# EAGLE design BLDController_v1.0 (EAGLE 6.6.0)
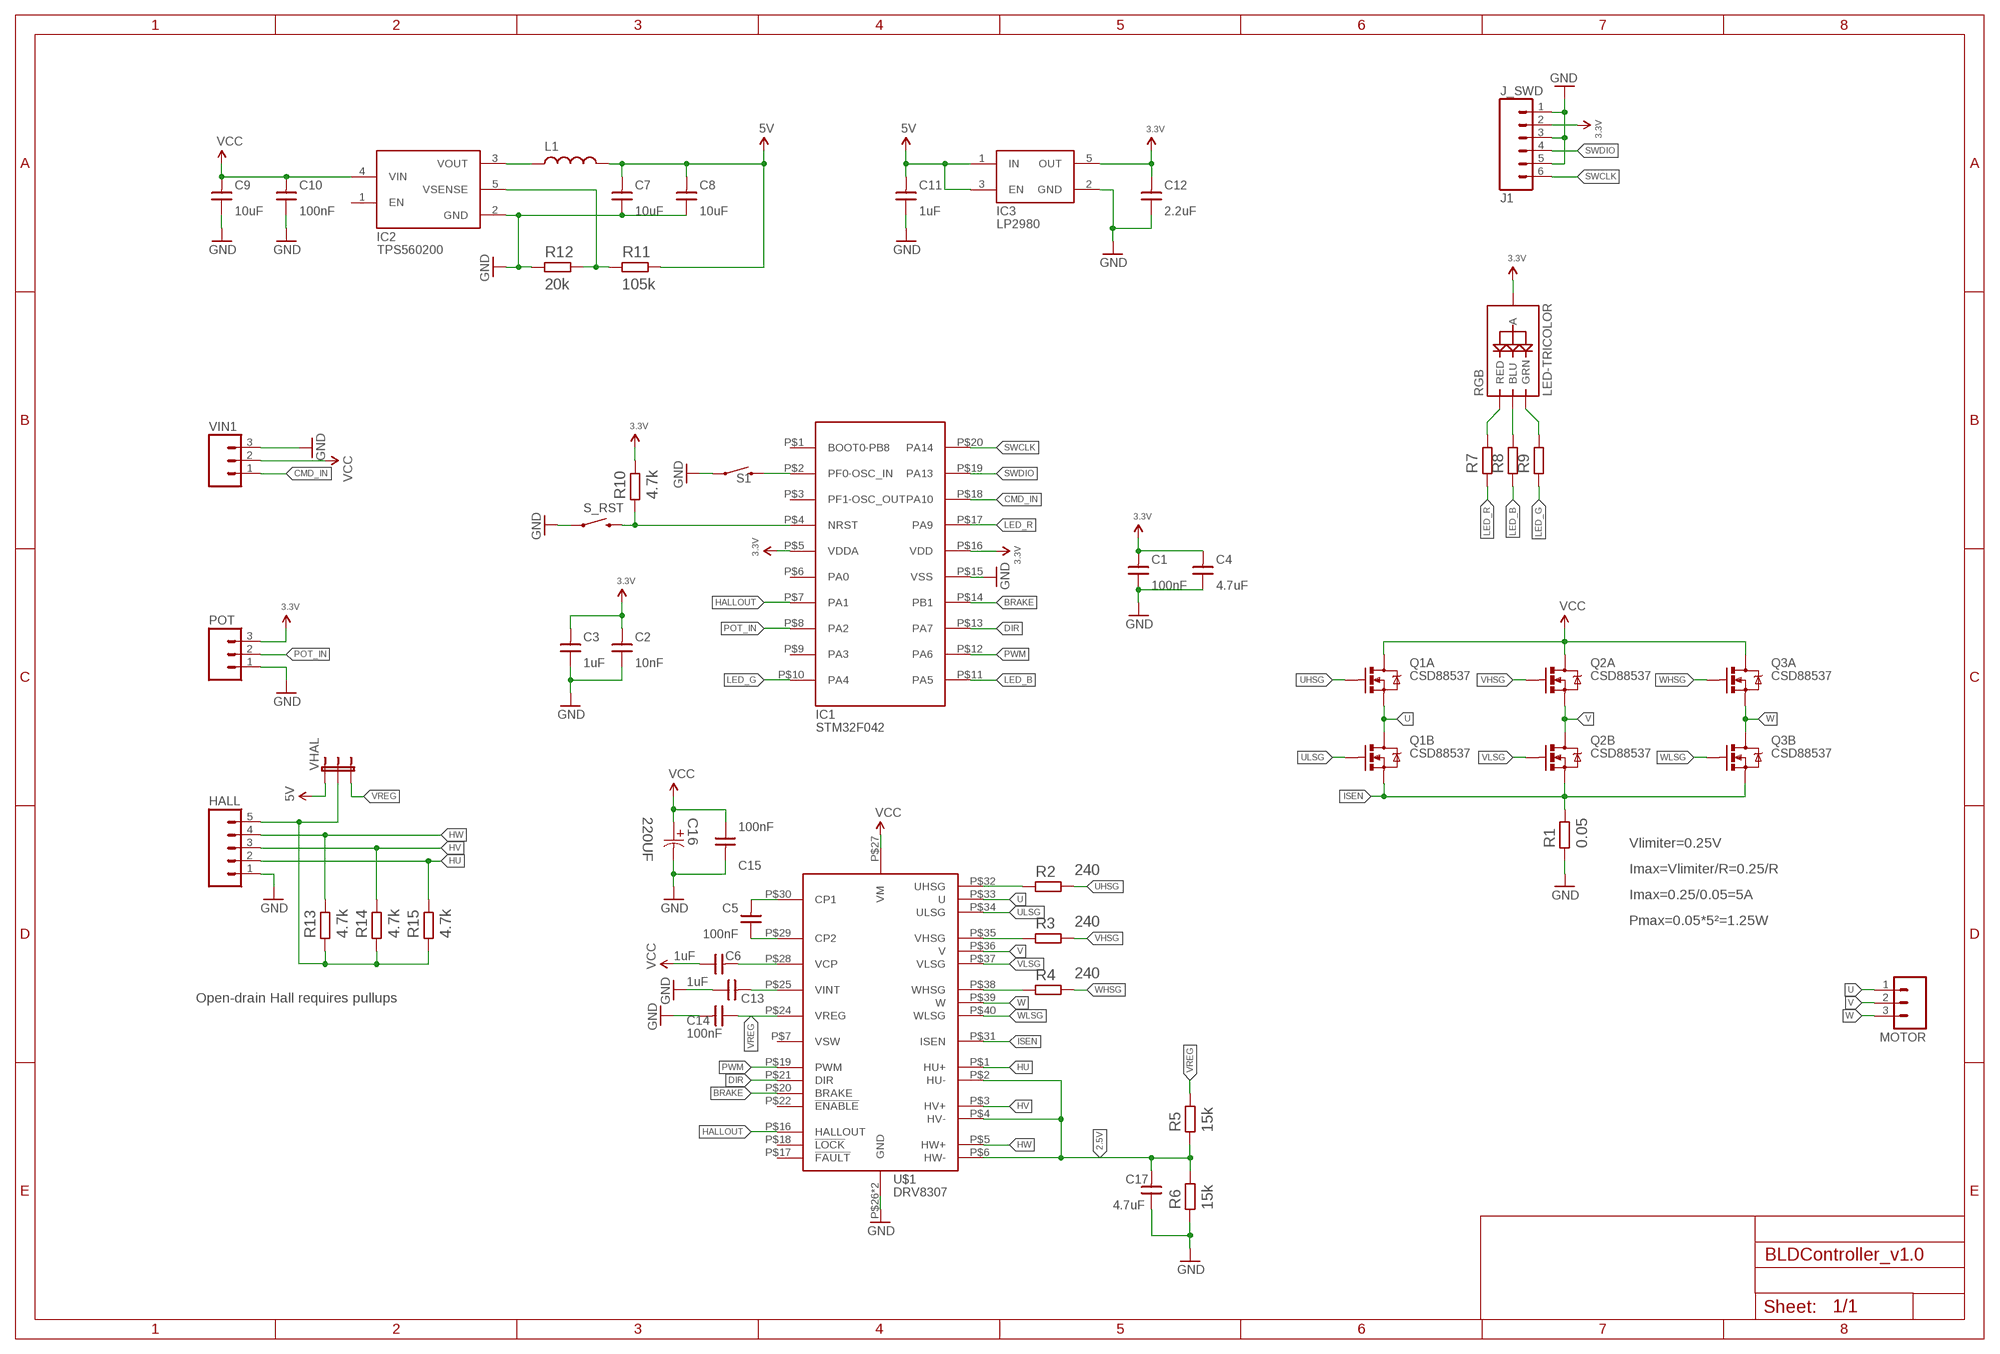
[diagram p0: schematic, sheet 1]

## Parts
C1  100nF  C0603  [R0603]
C2  10nF  C0603  [R0603]
C3  1uF  C0805  [R0805]
C4  4.7uF  C0805  [R0805]
C5  100nF  C0603  [R0603]
C6  1uF  C0805  [R0805]
C7  10uF  C0805  [R0805]
C8  10uF  C0805  [R0805]
C9  10uF  C1206  [1206]
C10  100nF  C0603  [R0603]
C11  1uF  C0805  [R0805]
C12  2.2uF  C0805  [R0805]
C13  1uF  C0805  [R0805]
C14  100nF  C0603  [R0603]
C15  100nF  C0603  [R0603]
C16  220UF  C_PANAFC1V221-P5.0-D10  [CAPPR500-1000X3200]
C17  4.7uF  C0603  [R0603]
HALL  M05SCREW  [SCREWTERMINAL-3.5MM-5]
IC1  STM32F042  [TSSOP20]
IC2  TPS560200  [SOT23-5L]
IC3  LP2980  [SOT23-5L]
J1  J_SWD  ZIF-06-1MM  [ZIF-06-1MM]
L1  LNRG_4026  [NRG_4026]
MOTOR  M03-SCREW-5MM  [SCREWTERMINAL-5MM-3]
POT  M03SCREW  [SCREWTERMINAL-3.5MM-3]
Q1  CSD88537  [SO-08]
Q2  CSD88537  [SO-08]
Q3  CSD88537  [SO-08]
R1  0.05  R2512  [CRF2512]
R2  240  R0603  [R0603]
R3  240  R0603  [R0603]
R4  240  R0603  [R0603]
R5  15k  R0603  [R0603]
R6  15k  R0603  [R0603]
R7  R0603  [R0603]
R8  R0603  [R0603]
R9  R0603  [R0603]
R10  4.7k  R0603  [R0603]
R11  105k  R0603  [R0603]
R12  20k  R0603  [R0603]
R13  4.7k  R0603  [R0603]
R14  4.7k  R0603  [R0603]
R15  4.7k  R0603  [R0603]
RGB  LED-TRICOLOR  [PLCC4]
S1  SWITCH-MOMENTARY-2SMD-3  [TACTILE_SWITCH_SMD-3]
S_RST  SWITCH-MOMENTARY-2SMD-3  [TACTILE_SWITCH_SMD-3]
U$1  DRV8307  [PVQFN-N40]
VHAL  JUMPER-3SMD  [SJ_3]
VIN1  M03SCREW  [SCREWTERMINAL-3.5MM-3]

## Nets
2.5V: C17.2 R5.1 R6.2 U$1.P$2(HU-) U$1.P$4(HV-) U$1.P$6(HW-)
3.3V: C1.2 C2.2 C3.2 C4.2 C12.2 IC1.P$5(VDDA) IC1.P$16(VDD) IC3.5(OUT) J1.2 POT.3 R10.2 RGB.P$1(A)
5V: C7.2 C8.2 C11.2 IC3.1(IN) IC3.3(EN) L1.P$2 R11.2 VHAL.1
BRAKE: IC1.P$14(PB1) U$1.P$20(BRAKE)
CMD_IN: IC1.P$18(PA10) VIN1.1
DIR: IC1.P$13(PA7) U$1.P$21(DIR)
GND: C1.1 C2.1 C3.1 C4.1 C7.1 C8.1 C9.1 C10.1 C11.1 C12.1 C13.1 C14.2 C15.2 C16.2 C17.1 HALL.1 IC1.P$15(VSS) IC2.2(GND) IC3.2(GND) J1.1 J1.3 J1.5 POT.1 R1.P$1 R6.1 R12.1 S1.1 S_RST.1 U$1.P$26(GND) U$1.PAD(GND) VIN1.3
HALLOUT: IC1.P$7(PA1) U$1.P$16(HALLOUT)
HU: HALL.2 R15.2 U$1.P$1(HU+)
HV: HALL.3 R14.2 U$1.P$3(HV+)
HW: HALL.4 R13.2 U$1.P$5(HW+)
ISEN: Q1.3(B:S) Q2.3(B:S) Q3.3(B:S) R1.P$2 U$1.P$31(ISEN)
LED_B: IC1.P$11(PA5) R8.1
LED_G: IC1.P$10(PA4) R9.1
LED_R: IC1.P$17(PA9) R7.1
N$1: C5.2 U$1.P$30(CP1)
N$2: C5.1 U$1.P$29(CP2)
N$4: C13.2 U$1.P$25(VINT)
N$5: C6.2 U$1.P$28(VCP)
N$6: R4.1 U$1.P$38(WHSG)
N$9: R7.2 RGB.P$4(RED)
N$10: R8.2 RGB.P$2(BLU)
N$11: R9.2 RGB.P$3(GRN)
N$12: R2.1 U$1.P$32(UHSG)
N$13: R3.1 U$1.P$35(VHSG)
N$18: IC1.P$4(NRST) R10.1 S_RST.4
N$27: IC2.3(VOUT) L1.P$1
N$29: IC2.5(VSENSE) R11.1 R12.2
POT_IN: IC1.P$8(PA2) POT.2
PWM: IC1.P$12(PA6) U$1.P$19(PWM)
SW1: IC1.P$2(PF0-OSC_IN) S1.4
SWCLK: IC1.P$20(PA14) J1.6
SWDIO: IC1.P$19(PA13) J1.4
U: MOTOR.1 Q1.1(A:S) Q1.5(B:D) Q1.6(B:D) U$1.P$33(U)
UHSG: Q1.2(A:G) R2.2
ULSG: Q1.4(B:G) U$1.P$34(ULSG)
V: MOTOR.2 Q2.1(A:S) Q2.5(B:D) Q2.6(B:D) U$1.P$36(V)
VCC: C6.1 C9.2 C10.2 C15.1 C16.1 IC2.4(VIN) Q1.7(A:D) Q1.8(A:D) Q2.7(A:D) Q2.8(A:D) Q3.7(A:D) Q3.8(A:D) U$1.P$27(VM) VIN1.2
VHALL: HALL.5 R13.1 R14.1 R15.1 VHAL.2
VHSG: Q2.2(A:G) R3.2
VLSG: Q2.4(B:G) U$1.P$37(VLSG)
VREG: C14.1 R5.2 U$1.P$24(VREG) VHAL.3
W: MOTOR.3 Q3.1(A:S) Q3.5(B:D) Q3.6(B:D) U$1.P$39(W)
WHSG: Q3.2(A:G) R4.2
WLSG: Q3.4(B:G) U$1.P$40(WLSG)
Unconnected: IC1.P$1(BOOT0-PB8) IC1.P$3(PF1-OSC_OUT) IC1.P$6(PA0) IC1.P$9(PA3) IC2.1(EN) U$1.P$7(VSW) U$1.P$17(!FAULT) U$1.P$18(!LOCK) U$1.P$22(!ENABLE)

## Notes on the sheet
- Vlimiter=0.25V
- Imax=Vlimiter/R=0.25/R
- Imax=0.25/0.05=5A
- Pmax=0.05*5²=1.25W
- Open-drain Hall requires pullups

## Library data of the parts
C1-C15 C17 = 0SBLib:C
C16 = 0SBLib:C_PANA: Aluminum Electrolytic Capacitors; MPN: EEUFC1V221; OC_FARNELL: 9692282; OC_NEWARK: 80K8401; RATEDVOLTAGE: 35V; SUPPLIER: PANASONIC; TOLERANCE: ±20 %
HALL = 0SBLib:M05: Header 5 Standard 5-pin 0.1" header. Use with straight break away headers (SKU : PRT-00116), right angle break away headers (PRT-00553), swiss pins (PRT-00743), machine pins (PRT-00117), and female headers (PRT-00115). Molex polarized connector foot print use with SKU : PRT-08230 with associated crimp pins and housings.
IC1 = 0SBLib:STM32F042: ARM®-based 32-bit MCU, up to 32 KB Flash, crystal-less USB FS 2.0, CAN, 8 timers, ADC & comm. interfaces, 2.0 - 3.6 V
IC2 = 0SBLib:TPS560200
IC3 = 0SBLib:LP2980
J1 = 0SBLib:ZIF-06-1MM
L1 = 0SBLib:L
MOTOR POT VIN1 = 0SBLib:M03: Header 3 Standard 3-pin 0.1" header. Use with straight break away headers (SKU : PRT-00116), right angle break away headers (PRT-00553), swiss pins (PRT-00743), machine pins (PRT-00117), and female headers (PRT-00115). Molex polarized connector foot print use with SKU : PRT-08232 with associated crimp pins and housings.
Q1-Q3 = 0SBLib:CSD88537
R1-R15 = 0SBLib:R
RGB = 0SBLib:LED-TRICOLOR: Tri-Color LED SMD Proven layout and schematic for triple color LED in SMD package - common anode. Spark Fun Electronics SKU : COM-07844
S1 S_RST = SparkFun-Electromechanical:SWITCH-MOMENTARY-2: Various NO switches- pushbuttons, reed, etc
U$1 = 0SBLib:DRV8307
VHAL = 0SBLib:JUMPER-3

## Board
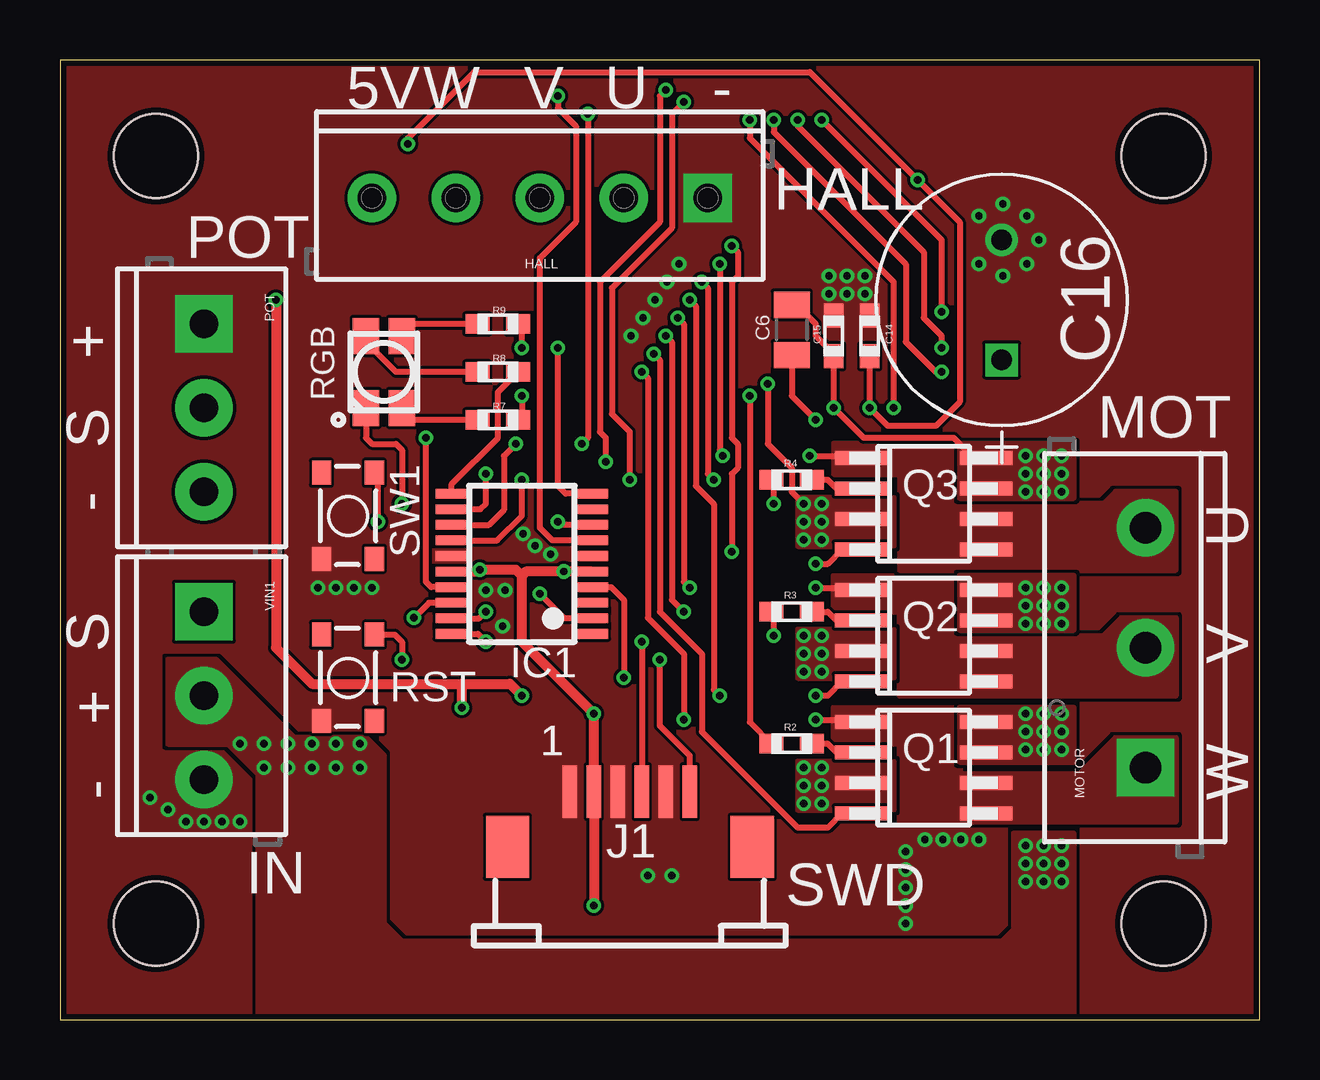
[diagram p1: board, top side]
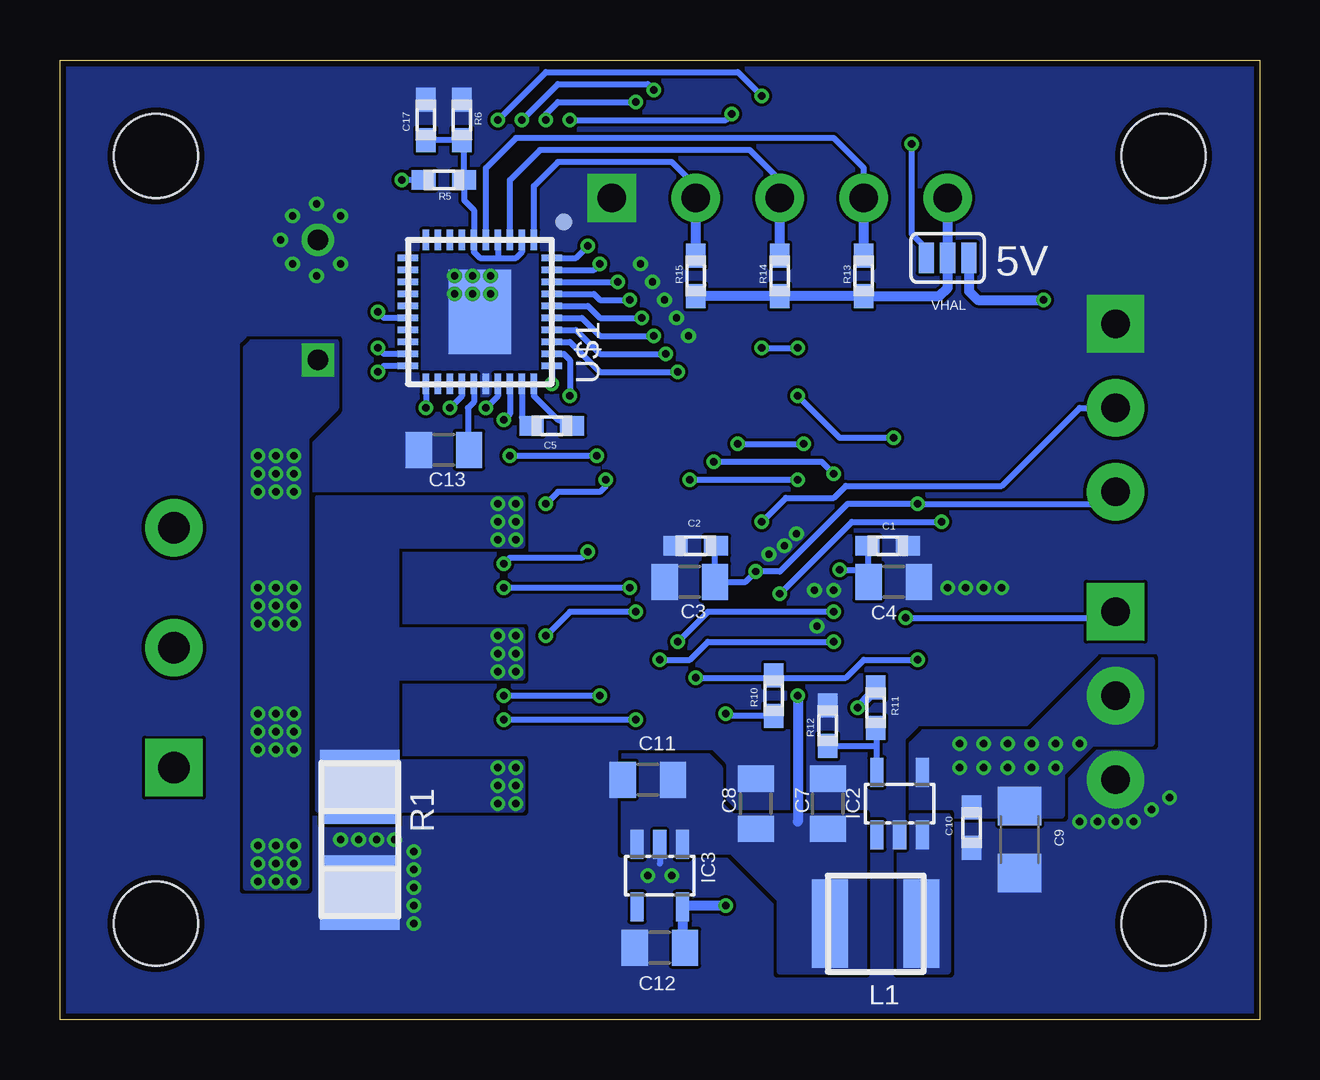
[diagram p2: board, bottom side, seen from below]

Size 50 x 40 mm. Coordinates in mm from the lower left corner, seen from the top.
Outline: 0,0 50,0 50,40 0,40 0,0
Copper layers (1*16): Top 0.035mm / dielectric 1.5mm / Bottom 0.035mm
Design rules "dirt_cheap_dirty_boards.v1": minimum track width 5mil, minimum drill 12mil, track to track 5mil, track to pad 5mil, pad to pad 5mil, via to via 5mil, smd to smd 0mil, copper to edge 10mil, drill to drill 10mil, minimum pad ring 10mil, minimum via ring 6mil, stop-mask expansion 2mil, vias tented up to drill 25mil, thermal gap 10mil
Holes 3.5 mm at 4,4 46,4 46,36 4,36

### Footprints (pad centres in the part's own frame; a part is rotated, then mirrored left to right if it is on the bottom)
R0603 = smd 1 x 0.8: 1 -0.85,0; 2 0.85,0
R0805 = smd 1.1 x 1.5: 1 -1.05,0; 2 1.05,0
1206 = smd 1.6 x 1.8: 1 -1.4,0; 2 1.4,0
CAPPR500-1000X3200 = drill 0.864 square: 1 -5.004,0 | drill 0.864: 2 0,0
SCREWTERMINAL-3.5MM-5 = drill 1.2 pad 2.032 square: 1 0,0 | drill 1.2 pad 2.032: 2 3.5,0; 3 7,0; 4 10.5,0; 5 14,0
TSSOP20 = smd 0.4 x 1.35: P$1 -2.925,-2.925; P$2 -2.275,-2.925; P$3 -1.625,-2.925; P$4 -0.975,-2.925; P$5 -0.325,-2.925; P$6 0.325,-2.925; P$7 0.975,-2.925; P$8 1.625,-2.925; P$9 2.275,-2.925; P$10 2.925,-2.925; P$11 2.925,2.925; P$12 2.275,2.925; P$13 1.625,2.925; P$14 0.975,2.925; P$15 0.325,2.925; P$16 -0.325,2.925; P$17 -0.975,2.925; P$18 -1.625,2.925; P$19 -2.275,2.925; P$20 -2.925,2.925
SOT23-5L = smd 0.55 x 1.2: 1 -0.95,-1.3; 2 0,-1.3; 3 0.95,-1.3; 4 0.95,1.3; 5 -0.95,1.3
ZIF-06-1MM = smd 0.6 x 2.2: 1 -2.5,1; 2 -1.5,1; 3 -0.5,1; 4 0.5,1; 5 1.5,1; 6 2.5,1 | smd 1.8 x 2.6: H1 -5.1,-1.3; H2 5.1,-1.3
NRG_4026 = smd 1.5 x 3.7: P$1 -1.9,0; P$2 1.9,0
SCREWTERMINAL-5MM-3 = drill 1.3 pad 2.413 square: 1 0,0 | drill 1.3 pad 2.413: 2 5,0; 3 10,0
SCREWTERMINAL-3.5MM-3 = drill 1.2 pad 2.413 square: 1 0,0 | drill 1.2 pad 2.413: 2 3.5,0; 3 7,0
SO-08 = smd 0.6 x 2.2: 1 -1.905,-2.6; 2 -0.635,-2.6; 3 0.635,-2.6; 4 1.905,-2.6; 5 1.905,2.6; 6 0.635,2.6; 7 -0.635,2.6; 8 -1.905,2.6
CRF2512 = smd 3.1 x 3.3: P$1 -2.2,0; P$2 2.2,0
PLCC4 = smd 1.1 x 1.5: P$1 -0.75,-1.5; P$2 -0.75,1.5; P$3 0.75,1.5; P$4 0.75,-1.5
TACTILE_SWITCH_SMD-3 = smd 1 x 0.8: 1 -1.8,1.1; 2 1.8,1.1; 3 -1.8,-1.1; 4 1.8,-1.1
PVQFN-N40 = smd 0.28 x 0.85: P$1 -2.25,-3; P$2 -1.75,-3; P$3 -1.25,-3; P$4 -0.75,-3; P$5 -0.25,-3; P$6 0.25,-3; P$7 0.75,-3; P$8 1.25,-3; P$9 1.75,-3; P$10 2.25,-3; P$21 2.25,3; P$22 1.75,3; P$23 1.25,3; P$24 0.75,3; P$25 0.25,3; P$26 -0.25,3; P$27 -0.75,3; P$28 -1.25,3; P$29 -1.75,3; P$30 -2.25,3 | smd 0.85 x 0.28: P$11 3,-2.25; P$12 3,-1.75; P$13 3,-1.25; P$14 3,-0.75; P$15 3,-0.25; P$16 3,0.25; P$17 3,0.75; P$18 3,1.25; P$19 3,1.75; P$20 3,2.25; P$31 -3,2.25; P$32 -3,1.75; P$33 -3,1.25; P$34 -3,0.75; P$35 -3,0.25; P$36 -3,-0.25; P$37 -3,-0.75; P$38 -3,-1.25; P$39 -3,-1.75; P$40 -3,-2.25 | smd 2.62 x 3.52: PAD 0,0
SJ_3 = smd 0.635 x 1.27: 1 -0.889,0; 2 0,0; 3 0.889,0

### Placement (x,y rotation side)
C1  15.5,19.75 180 bottom
C2  23.5,19.75 0 bottom
C3  23.75,18.25 0 bottom
C4  15.25,18.25 180 bottom
C5  29.5,24.75 0 bottom
C6  30.5,28.75 270 top
C7  18,9 270 bottom
C8  21,9 270 bottom
C9  10,7.5 90 bottom
C10  12,8 90 bottom
C11  25.5,10 0 bottom
C12  25,3 0 bottom
C13  34,23.75 0 bottom
C14  33.75,28.5 90 top
C15  32.25,28.5 90 top
C16  39.25,32.5 90 top
C17  34.75,37.5 270 bottom
HALL  27,34.25 180 top
IC1  19.25,19 90 top
IC2  15,9 0 bottom
IC3  25,6 180 bottom
J1  23.75,8.5 0 top
L1  16,4 180 bottom
MOTOR  45.25,10.5 90 top
POT  6,29 270 top
Q1  36,10.5 270 top
Q2  36,16 270 top
Q3  36,21.5 270 top
R1  37.5,7.5 90 bottom
R2  30.5,11.5 0 top
R3  30.5,17 0 top
R4  30.5,22.5 0 top
R5  34,35 180 bottom
R6  33.25,37.5 270 bottom
R7  18.25,25 180 top
R8  18.25,27 180 top
R9  18.25,29 180 top
R10  20.25,13.5 270 bottom
R11  16,13 90 bottom
R12  18,12.25 270 bottom
R13  16.5,31 90 bottom
R14  20,31 90 bottom
R15  23.5,31 90 bottom
RGB  13.5,27 0 top
S1  12,21 90 top
S_RST  12,14.25 90 top
U$1  32.5,29.5 180 bottom
VHAL  13,31.75 180 bottom
VIN1  6,17 270 top

### Tracks (layer width: path | path; a pad name or v marks a point on that pad's centre or on a via)
2.5V
  Bottom 0.254: U$1.P$2 30.75,32 31,31.75 31.75,31.75 | 31.75,31.75 32.5,31.75 32.75,32 U$1.P$6 32.75,33.75 33.15,34.15 R5.1 33.15,36.55 R6.2 C17.2 | U$1.P$4 31.75,31.75
3.3V  (via drill 0.3)
  Top 0.254: RGB.P$1 12.75,24.25 13,24 14,24 14.25,23.75 v14.25,21.5
  Top 0.406: v22.25,4.75 J1.2 v22.25,12.75 19.25,15.75 19.25,18.5 | IC1.P$5 v21,18.68 19.43,18.68 19.25,18.5 | 19.25,18.5 19,18.75 v17.5,18.75 17.43,18.68 IC1.P$16
  Bottom 0.254: R10.2 22.15,12.65 v22.25,12.75 | C1.2 16.3,19.7 C4.2 16.3,18.65 16.4,18.75 v17.5,18.75 | C2.2 22.7,19.7 C3.2 21.43,18.25 v21,18.68 20,18.68 17.18,21.5 v14.25,21.5 6.5,21.5 POT.3
  Bottom 0.406: v22.25,4.75 24,4.75 IC3.5 24.05,3.1 C12.2
5V  (via drill 0.3)
  Top 0.406: v9,30 9,15.5 10.5,14 16.75,14 | 16.75,14 18.75,14 v19.25,13.5 | v16.75,13 16.75,14
  Bottom 0.254: R11.2 16.15,13.85
  Bottom 0.406: v9,30 11.75,30 12.11,30.36 VHAL.1 | v19.25,13.5 19.25,8.25 | 16.15,13.85 16.15,13.6 v16.75,13
  pour Bottom (rank 3, no thermals): 16.5,8.5 16.5,2 20,2 20,5 22,7 26.5,7 26.5,11 23,11 22.5,10.5 22.5,9 22,8.5
BRAKE  (via drill 0.3)
  Top 0.254: v36.75,27 36.5,27 35.25,28.25 35.25,31.5 29.75,37 v29.75,37.5 | v26,38.25 25.5,37.75 25.5,33 23,30.5 23,25.25 23.75,24.5 v23.75,22.5 | IC1.P$14 18.23,19.98 19.25,21 v19.25,22.5
  Bottom 0.254: U$1.P$20 36.5,27.25 v36.75,27 | v29.75,37.5 29.75,37.75 29.25,38.25 v26,38.25 | v19.25,22.5 v23.75,22.5
CMD_IN  (via drill 0.3)
  Top 0.254: IC1.P$18 15.38,17.38 v14.75,16.75
  Bottom 0.254: v14.75,16.75 6.25,16.75 VIN1.1
DIR  (via drill 0.3)
  Top 0.254: v34.75,25.5 34.75,30.75 28.75,36.75 v28.75,37.5 | v22,37.75 22,24.25 v21.75,24 | v19,24 18.5,23.5 18.5,21.25 17.88,20.62 IC1.P$13
  Bottom 0.254: U$1.P$21 v34.75,25.5 | v28.75,37.5 22.25,37.5 v22,37.75 | v21.75,24 v19,24
GND  (via drill 0.3)
  Bottom 0.254: IC3.2 25,6.5
  other vias: 35.25,7 35.25,6.25 35.25,5.5 35.25,4.75 35.25,4 24.5,6 25.5,6 6,8.25 6.75,8.25 5.25,8.25 4.5,8.75 7.5,8.25 3.75,9.25 10.75,18 11.5,18 12.25,18 13,18 19.3,20.25 19.8,19.75 20.45,19.4 17.75,17.9 18.55,17.9 18.45,16.4 38.3,31.5 40.3,31.5 40.3,33.5 38.3,33.5 39.3,31 40.8,32.5 39.3,34 36.05,7.5 36.8,7.5 37.55,7.5 38.3,7.5 32.05,30.25 32.8,30.25 33.55,30.25 33.55,31 32.8,31 32.05,31 23.8,28.5 24.3,29.25 24.8,30 25.3,30.75 25.8,31.5
  pour Top (rank 5, no thermals): 0,40 50,40 50,0 0,0
  pour Bottom (rank 5, no thermals): 0,40 50,40 50,0 0,0
HALLOUT  (via drill 0.3)
  Top 0.254: v36.75,29.5 36.75,32.5 v31.75,37.5 | v20.75,38.5 20.75,38 21.5,37.25 21.5,33.25 20,31.75 20,20.5 20.52,19.98 IC1.P$7
  Bottom 0.254: U$1.P$16 36.5,29.25 v36.75,29.5 | v31.75,37.5 29.75,39.5 21.75,39.5 v20.75,38.5
HU
  Bottom 0.254: HALL.2 23.5,34.75 24.5,35.75 29.25,35.75 30.25,34.75 U$1.P$1
  Bottom 0.406: R15.2 HALL.2
HV
  Bottom 0.254: HALL.3 20,35 21.25,36.25 30,36.25 31.25,35 U$1.P$3
  Bottom 0.406: R14.2 HALL.3
HW
  Bottom 0.254: HALL.4 16.5,35.5 17.75,36.75 31,36.75 32.25,35.5 U$1.P$5
  Bottom 0.406: R13.2 HALL.4
ISEN  (via drill 0.3)
  Top 0.254: v29.5,26.5 29.5,24 30.5,23 30.5,22 v31,21.5
  Bottom 0.254: U$1.P$31 v29.5,26.5
  other vias: 31.75,21.5 31,20.75 31.75,20.75 31,20 31.75,20 31,16 31.75,16 31.75,15.25 31,15.25 31,14.5 31.75,14.5 31,10.5 31.75,10.5 31.75,9.75 31,9.75 31,9 31.75,9
  pour Top (rank 2, no thermals): 34.75,16.25 30.75,16.25 30.75,14.25 34.75,14.25
  pour Top (rank 2, no thermals): 34.75,10.75 30.75,10.75 30.75,8.75 34.75,8.75
  pour Top (rank 2, no thermals): 34.75,21.75 30.75,21.75 30.75,19.75 34.75,19.75
  pour Bottom (rank 2, no thermals): 30.75,10.75 30.75,8.75 39.25,8.75 39.25,21.75 30.75,21.75 30.75,19.75 36,19.75 36,16.25 30.75,16.25 30.75,14.25 36,14.25 36,10.75
LED_B
  Top 0.254: IC1.P$11 16.32,22.32 18.25,24.25 18.25,26.15 R8.1
LED_G  (via drill 0.3)
  Top 0.254: IC1.P$10 21.07,21.93 20.75,22.25 v20.75,28 | v19.25,28 19.25,28.85 R9.1
  Bottom 0.254: v20.75,28 v19.25,28
LED_R  (via drill 0.3)
  Top 0.254: IC1.P$17 15.47,18.02 15.25,18.25 v15.25,24.25 | v19.25,26 19.25,25.15 R7.1
  Bottom 0.254: v15.25,24.25 17.5,24.25 v19.25,26
N$1
  Bottom 0.254: U$1.P$30 30.25,26 29.25,25 C5.2
N$2
  Bottom 0.254: U$1.P$29 30.75,25.1 C5.1
N$4
  Bottom 0.254: U$1.P$25 32.75,25.75 33,25.5 33,23.8 C13.2
N$5  (via drill 0.3)
  Top 0.254: C6.2 30.5,26 v31.5,25
  Bottom 0.254: U$1.P$28 31.25,25.25 v31.5,25
N$6  (via drill 0.3)
  Top 0.254: v26.75,30.75 27,30.5 27,22.75 v27.25,22.5 | v29.75,21.5 29.75,22.4 R4.1
  Bottom 0.254: U$1.P$38 v26.75,30.75 | v27.25,22.5 27.25,22.25 27.5,22 29.25,22 v29.75,21.5
N$9
  Top 0.254: R7.2 14.75,25 RGB.P$4
N$10
  Top 0.254: R8.2 14,27 12.75,28.25 RGB.P$2
N$11
  Top 0.254: R9.2 14.75,29 RGB.P$3
N$12  (via drill 0.3)
  Top 0.254: v28.75,26 28.75,12.4 R2.1
  Bottom 0.254: U$1.P$32 29,27.75 28.75,27.5 v28.75,26
N$13  (via drill 0.3)
  Top 0.254: v25.25,28.5 25.5,28.25 25.5,17.5 v26,17 | v29.75,16 29.75,16.9 R3.1
  Bottom 0.254: U$1.P$35 28.25,29.25 27.5,28.5 v25.25,28.5 | v26,17 28.75,17 v29.75,16
N$18  (via drill 0.3)
  Top 0.254: IC1.P$4 22.98,18.02 23.5,17.5 v23.5,14.25 | S_RST.4 13.95,16.05 14.25,15.75 v14.25,15
  Bottom 0.254: v23.5,14.25 20.25,14.25 | 20.25,14.25 17.25,14.25 16.5,15 v14.25,15 | R10.1 20.25,14.25
N$27
  pour Bottom (rank 2, no thermals): 13,8.5 13,2 15,2 15,7 14.5,7.5 14.5,8.5
N$29
  Bottom 0.254: IC2.5 15.95,11.5 | 15.95,11.5 15.95,12.1 R11.1 16.05,12.1 | R12.2 16.05,11.4 15.95,11.5
POT_IN  (via drill 0.3)
  Top 0.254: IC1.P$8 20.88,20.62 v20.75,20.75
  Bottom 0.254: v20.75,20.75 19.75,21.75 17.75,21.75 17.25,22.25 10.75,22.25 7.5,25.5 POT.2
PWM  (via drill 0.3)
  Top 0.254: v36.75,28 36.75,28.5 36,29.25 36,32 30.75,37.25 v30.75,37.5 | v25.25,38.75 25,38.5 25,33.25 22.5,30.75 22.5,24.5 22.75,24.25 v22.75,23.25 | IC1.P$12 17.52,21.27 17.75,21.5 v17.75,22.75
  Bottom 0.254: U$1.P$19 36.5,27.75 v36.75,28 | v30.75,37.5 29.25,39 25.5,39 v25.25,38.75 | v17.75,22.75 18.25,23.25 v22.75,23.25
SW1  (via drill 0.3)
  Top 0.254: IC1.P$2 21.02,16.73 v20,17.75 | v13.25,20.75 13.25,22.65 S1.4
  Bottom 0.254: v20,17.75 17,20.75 v13.25,20.75
SWCLK  (via drill 0.3)
  Top 0.254: J1.6 26.25,11 25,12.25 v25,15 | 17.5,16 v17.75,15.75 17.43,16.07 IC1.P$20
  Bottom 0.254: v25,15 23.75,15 23,15.75 v17.75,15.75
SWDIO  (via drill 0.3)
  Top 0.254: IC1.P$19 17.48,16.73 v17.75,17 | v24.25,15.75 J1.4
  Bottom 0.254: v17.75,17 23,17 v24.25,15.75
U  (via drill 0.3)
  Top 0.254: v24.25,27 24.5,26.75 24.5,16.75 26,15.25 v26,12.5 | v31.5,12.5 33.3,12.5 Q1.1
  Bottom 0.254: U$1.P$33 28.75,28.25 27.5,27 v24.25,27 | v26,12.5 v31.5,12.5
  pour Top (rank 3, no thermals): 46.5,11.75 46.5,8.25 35,8.25 35,11.5 32.25,11.5 32.25,13 37.5,13 37.5,10.25 42.5,10.25 44,11.75
UHSG
  Top 0.254: Q1.2 32.37,11.13 32,11.5 R2.2
ULSG  (via drill 0.3)
  Top 0.254: v24.75,27.75 25,27.5 25,17 26.75,15.25 26.75,12 30.75,8 32,8 32.59,8.6 Q1.4
  Bottom 0.254: U$1.P$34 28.5,28.75 27.5,27.75 v24.75,27.75
V  (via drill 0.3)
  Top 0.254: v25.75,29.25 26,29 26,18.25 v26.25,18 | v31.5,18 33.3,18 Q2.1
  Bottom 0.254: U$1.P$36 28,29.75 27.5,29.25 v25.75,29.25 | v26.25,18 v31.5,18
  pour Top (rank 4, no thermals): 35,13.5 35,17 32.25,17 32.25,18.5 37.5,18.5 37.5,16 43.5,16 44.25,16.75 46.5,16.75 46.5,13.5
VCC  (via drill 0.3)
  Top 0.254: C6.1 30.7,29.8 31.5,29 31.5,28.5 32.25,27.75 C15.1 v32.25,25.5 33.5,24.25 37.25,24.25 38.09,23.41 Q3.8
  Bottom 0.254: U$1.P$27 31.75,26 v32.25,25.5
  other vias: 10.5,11.5 11.5,11.5 12.5,11.5 10.5,10.5 11.5,10.5 12.5,10.5 9.5,11.5 8.5,11.5 7.5,11.5 8.5,10.5 9.5,10.5 40.25,11.25 41,11.25 41.75,11.25 41.75,12 41.75,12.75 41,12 40.25,12 40.25,12.75 41,12.75 40.25,16.5 41,16.5 41.75,16.5 41.75,17.25 41.75,18 41,17.25 40.25,17.25 40.25,18 41,18 40.25,22 41,22 41.75,22 41.75,22.75 41,22.75 40.25,22.75 40.25,23.5 41,23.5 41.75,23.5 40.25,7.25 41,7.25 41.75,7.25 41.75,6.5 41,6.5 40.25,6.5 40.25,5.75 41,5.75 41.75,5.75
  pour Bottom (rank 3, no thermals): 4.5,15 4.5,11.5 7,11.5 8.25,10.25 8.25,8.5 14.5,8.5 14.5,11.5 14,12 9.5,12 6.5,15
  pour Top (rank 2, no thermals): 37.5,24 37.5,21.75 42.25,21.75 42.25,24
  pour Top (rank 2, no thermals): 37.5,18.5 37.5,16.25 42.25,16.25 42.25,18.5
  pour Top (rank 2, no thermals): 37.5,13 37.5,10.75 42.25,10.75 42.25,13
  pour Bottom (rank 2, no thermals): 39.75,24.25 39.75,5.5 42.25,5.5 42.25,28 42,28.25 38.5,28.25 38.5,25.5
  pour Top (rank 2, no thermals): 4.5,15 4.5,11.5 7,11.5 8.25,10.25 8.25,0.25 42.25,0.25 42.25,7.75 39.75,7.75 39.75,3.75 39.25,3.25 14.25,3.25 13.5,4 13.5,11 12.75,11.75 9.75,11.75 6.5,15
VHALL
  Bottom 0.406: R15.1 R14.1 R13.1 13.35,30.15 13,30.5 VHAL.2 HALL.5
VHSG
  Top 0.254: Q2.2 32.37,16.64 32,17 R3.2
VLSG  (via drill 0.3)
  Top 0.254: Q2.4 32.59,14.1 32,13.5 v31.5,13.5 | v26.25,30 26.5,29.75 26.5,22.25 27.25,21.5 27.25,13.75 v27.5,13.5
  Bottom 0.254: U$1.P$37 27.75,30.25 27.5,30 v26.25,30 | v27.5,13.5 v31.5,13.5
VREG  (via drill 0.3)
  Top 0.254: C14.1 v33.75,25.5 34.5,24.75 36.5,24.75 37.5,25.75 37.5,33.25 v35.75,35 31.25,39.5 17.25,39.5 14.5,36.75 v14.5,36.5
  Bottom 0.254: U$1.P$24 33.25,26 v33.75,25.5 | R5.2 v35.75,35 | VHAL.3 13.89,32.14 14.5,32.75 v14.5,36.5
W  (via drill 0.3)
  Top 0.254: v27.5,31.5 27.5,23.75 27.62,23.62 v27.62,23.5 | v31.25,23.5 33.3,23.5 Q3.1
  Bottom 0.254: U$1.P$39 27.75,31.25 v27.5,31.5 | v27.62,23.5 v31.25,23.5
  pour Top (rank 3, no thermals): 35,22.75 35,18.75 46.5,18.75 46.5,22 44,22 43.5,21.5 37.75,21.5 37.25,22 37.25,24 32.25,24 32.25,22.75
WHSG
  Top 0.254: Q3.2 32.37,22.14 32,22.5 R4.2
WLSG  (via drill 0.3)
  Top 0.254: v28,32.25 28.25,32 28.25,31 28,30.75 28,24.25 28.25,24 28.25,23 28,22.75 v28,19.5 | v31.5,19 32,19 32.59,19.59 Q3.4
  Bottom 0.254: U$1.P$40 28.5,31.75 v28,32.25 | v28,19.5 28.25,19.25 31.25,19.25 v31.5,19

### Text on the board
tPlace: 5V | W | V | U | - | HALL | POT | + | S | MOT | - | U | SW1 | S | V | + | RST | W | 1 | - | IN | SWD
bPlace: 5V